# Altium schematic sheet Hardware.SchDoc
size A4; SheetNumber: 1; SheetTotal: 5
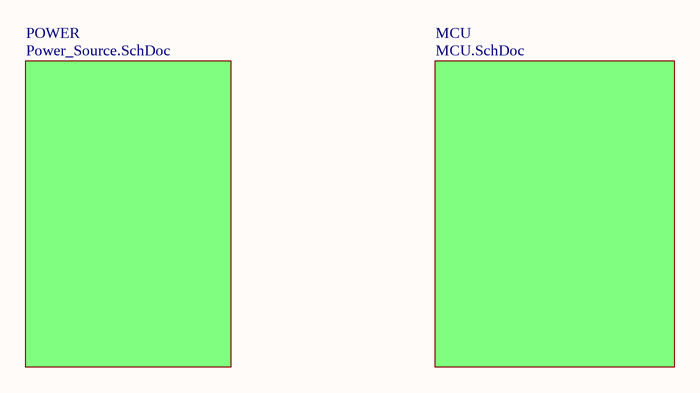
[diagram p0: Hardware.SchDoc]

## Sub-sheets
MCU = MCU.SchDoc: no entries
POWER = Power_Source.SchDoc: no entries